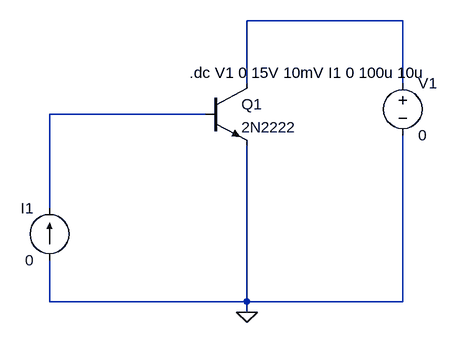
[diagram p0: schematic BJT.asc]
BJT.asc, the LTspice schematic file:
Version 4
SHEET 1 880 680
WIRE 320 -16 80 -16
WIRE 80 80 80 -16
WIRE 320 80 320 -16
WIRE 16 128 -224 128
WIRE -224 272 -224 128
WIRE -224 416 -224 352
WIRE 80 416 80 176
WIRE 80 416 -224 416
WIRE 320 416 320 160
WIRE 320 416 80 416
WIRE 80 432 80 416
FLAG 80 432 0
SYMBOL npn 16 80 R0
SYMATTR InstName Q1
SYMATTR Value 2N2222
SYMBOL voltage 320 64 R0
WINDOW 123 0 0 Left 0
WINDOW 39 0 0 Left 0
SYMATTR InstName V1
SYMATTR Value 0
SYMBOL current -224 352 R180
WINDOW 0 24 80 Left 2
WINDOW 3 24 0 Left 2
WINDOW 123 0 0 Left 0
WINDOW 39 0 0 Left 0
SYMATTR InstName I1
SYMATTR Value 0
TEXT -8 64 Left 2 !.dc V1 0 15V 10mV I1 0 100u 10u

The netlist it stands for:
* BJT.asc
Q1 N001 N002 0 0 2N2222
V1 N001 0 0
I1 0 N002 0
.model NPN NPN
.model PNP PNP
.lib standard.bjt
.dc V1 0 15V 10mV I1 0 100u 10u
.backanno
.end